# Altium project Mosfet H bridge.PrjPcb
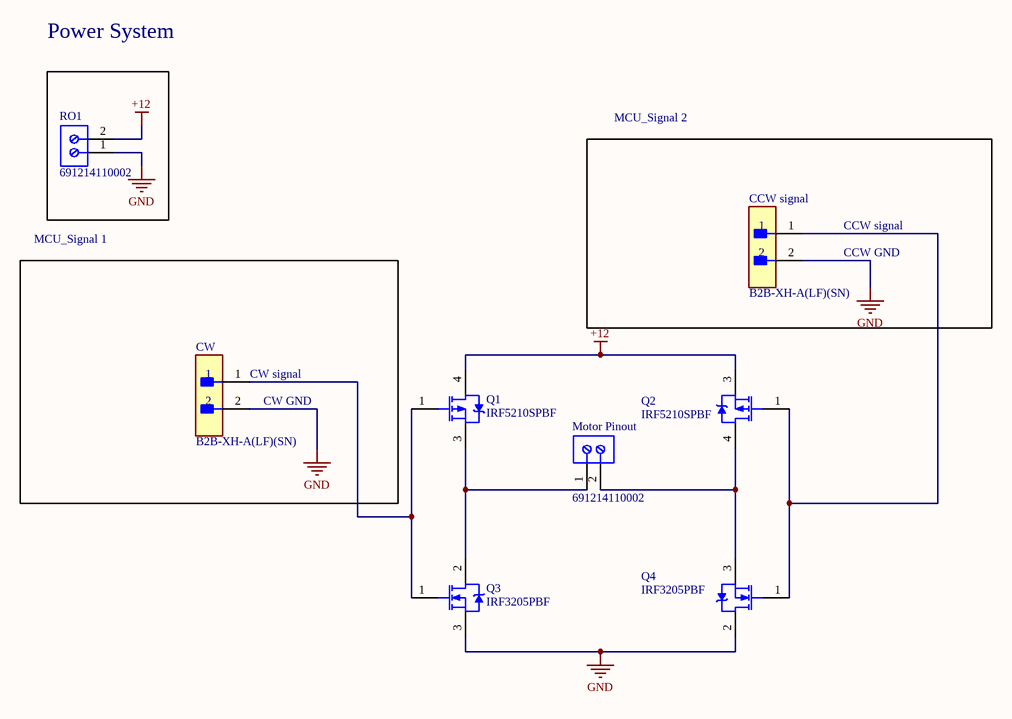
[diagram p0: Sheet1.SchDoc]
1 sheet, 8 parts. Net scope: global (net labels, ports and power ports of the same name join across sheets).
Board file: PCB1.PcbDoc

## Sheet Sheet1.SchDoc
size A; SheetNumber: 1; SheetTotal: 1

### Parts
CCW_signal  B2B-XH-A(LF)(SN)  [FP-B2B-XH-A_LF_SN-MFG]
CW  B2B-XH-A(LF)(SN)  [FP-B2B-XH-A_LF_SN-MFG]
Motor_Pinout  691214110002  [691214110002]
Q1  IRF5210SPBF  [INTR-TO-263-3_L]
Q2  IRF5210SPBF  [INTR-TO-263-3_L]
Q3  IRF3205PBF  [INF-PG-TO-220AB]
Q4  IRF3205PBF  [INF-PG-TO-220AB]
RO1  691214110002  [691214110002]

### Nets
+12: Q1.4(DRAIN) Q2.3(SOURCE) RO1.2
GND: CCW_signal.2 CW.2 Q3.3(S) Q4.2(D) RO1.1
NetCCW_signal_1: CCW_signal.1 Q2.1(GATE) Q4.1(G)
NetCW_1: CW.1 Q1.1(GATE) Q3.1(G)
NetMotor_Pinout_1: Motor_Pinout.1 Q1.3(SOURCE) Q3.2(D)
NetMotor_Pinout_2: Motor_Pinout.2 Q2.4(DRAIN) Q4.3(S)

### Notes on the sheet
- Power System
- MCU_Signal 2
- MCU_Signal 1
- CCW signal
- CCW GND
- (near CW) CW signal
- (near CW) CW GND

### Library data of the parts
CCW_signal CW = CMP-2000-05888-3: CONN HEADER VERT 2POS 2.5MM; Current Rating: 3A; Voltage Rating: 250V; Number of Contacts: 2; Contact Resistance: 20mR; Wire/Cable Gauge: 22AWG; Insulation Resistance: 1GR; Connector Type: Male Pin; Packaging: Bulk; Contact Material: Brass; Lead Free: Lead Free; Orientation: Straight; Contact Plating: Tin; Max Current Rating: 3A; Termination: Solder; Fastening Type: Detent; Depth: 5.75mm; Housing Material: Polyamide; REACH SVHC: No SVHC; Series: XH; Voltage Rating (AC): 250V; Number of Positions: 2; Color: Natural; Contact Type: Male Pin; Max Voltage Rating (DC): 250V; Pitch: 2.5mm; Lead Pitch: 2.5mm; Mount: Through Hole; Max Operating Temperature: 85°C; Length: 7.4mm; Max Voltage Rating (AC): 250V; Min Operating Temperature: -25°C; Number of Rows: 1; Housing Color: White
Motor_Pinout RO1 = CMP-1502-02464-2: NexarPartId: 18818288; Plating: Brass, Steel; Current: 10A; Pitch: 3.5052mm; Number of Levels: 1; Number of Contacts: 2; Wire Gauge (Min): 16AWG; Voltage: 300V; Wire Gauge (Max): 24AWG; Stripping Length: -6mm; Number of Pins: 2; Number of Rows: 1; REACH SVHC: Unknown; RoHS: Compliant; Housing Material: Nylon; Termination: Screw; Mount: Through Hole; Contact Plating: Brass, Tin; Number of Positions Per Level: 2; Color: Blue, Green; Width: 7.9mm; Voltage Rating: 300V; Length: 7.4mm; Current Rating: 10A; Wire/Cable Gauge: 24AWG; Packaging: Box; Max Operating Temperature: 105°C; Lead Pitch: 3.5mm; Height: 8.7mm; Contact Material: Brass; Min Operating Temperature: -40°C
Q1 Q2 = CMP-2000-06459-1: HEXFET(R) Power MOSFET, 3.1 W, 63 ns, -55 to 150 degC, 3-Pin DPAK (TO-263AB), RoHS, Tube; Manufacturer: International Rectifier; Drain-Source On Resistance-Max: 60mO; Rated Power Dissipation: 170W; Qg Gate Charge: 150nC; Channel Type: P-Channel; Drain-to-Source Voltage [Vdss]: 100V; Datasheet Version: 08/2009; Datasheet URL: https://datasheet.ciiva.com/15137/getdatasheetpartid-86705-15137623.pdf; Package Reference: TO-263-3; Package Description: 3-Pin Transistor Outline, Body 9.015 x 10.16 mm, Pitch 2.54 mm; Manufacturer URL: http://internationalrectifier.com/; Mounting Technology: SurfaceMount
Q3 Q4 = CMP-2000-04997-1: HEXFET(R) Power N-Channel MOSFET, 55 V, 110 A, -55 to 117 degC, 3-Pin TO-220AB, RoHS, Rail/Tube; Manufacturer: International Rectifier; Typical Gate Charge @ Vgs: 146nC@10V; Maximum Gate Source Voltage: ±20V; Maximum Continuous Drain Current: 110A; Typical Input Capacitance @ Vds: 3247pF@25V; Channel Type: N; Minimum Gate Threshold Voltage: 2V; Number of Elements per Chip: 1; Transistor Configuration: Single; Transistor Material: Si; Maximum Drain Source Voltage: 55V; Maximum Gate Threshold Voltage: 4V; Typical Turn-Off Delay Time: 50ns; Typical Turn-On Delay Time: 14ns; Channel Mode: Enhancement; Maximum Drain Source Resistance: 0.008Ω; Maximum Power Dissipation: 200W; Package Version: Feb-04; Package Type: TO-220AB; Width: 4.69mm; Dimensions: 10.54x4.69x8.77mm; Category: PowerMOSFET; Package URL: http://www.infineon.com/dgdl/bts110.pdf?folderId=db3a304412b407950112b43583c16310&fileId=db3a304412b407950112b43584326311&sId=db3a30443e3c704d013e4eb6657a2604; Package Description: 3-Pin Plastic (Green) Transistor Single Outline Package, 9.9 x 9.2 mm Body, 2.54 mm Pitch; Package Reference: PG-TO-220AB; Length: 10.54mm; Height: 8.77mm; Datasheet Version: Jul-10; Minimum Operating Temperature: -55degC; Manufacturer URL: http://internationalrectifier.com/; Datasheet URL: http://datasheet.octopart.com/IRF3205PBF-International-Rectifier-datasheet-10898897.pdf; Maximum Operating Temperature: +175degC; Pin Count: 3; Mounting Type: ThroughHole